# EAGLE schematic m2_to_apple (EAGLE 9.6.2)
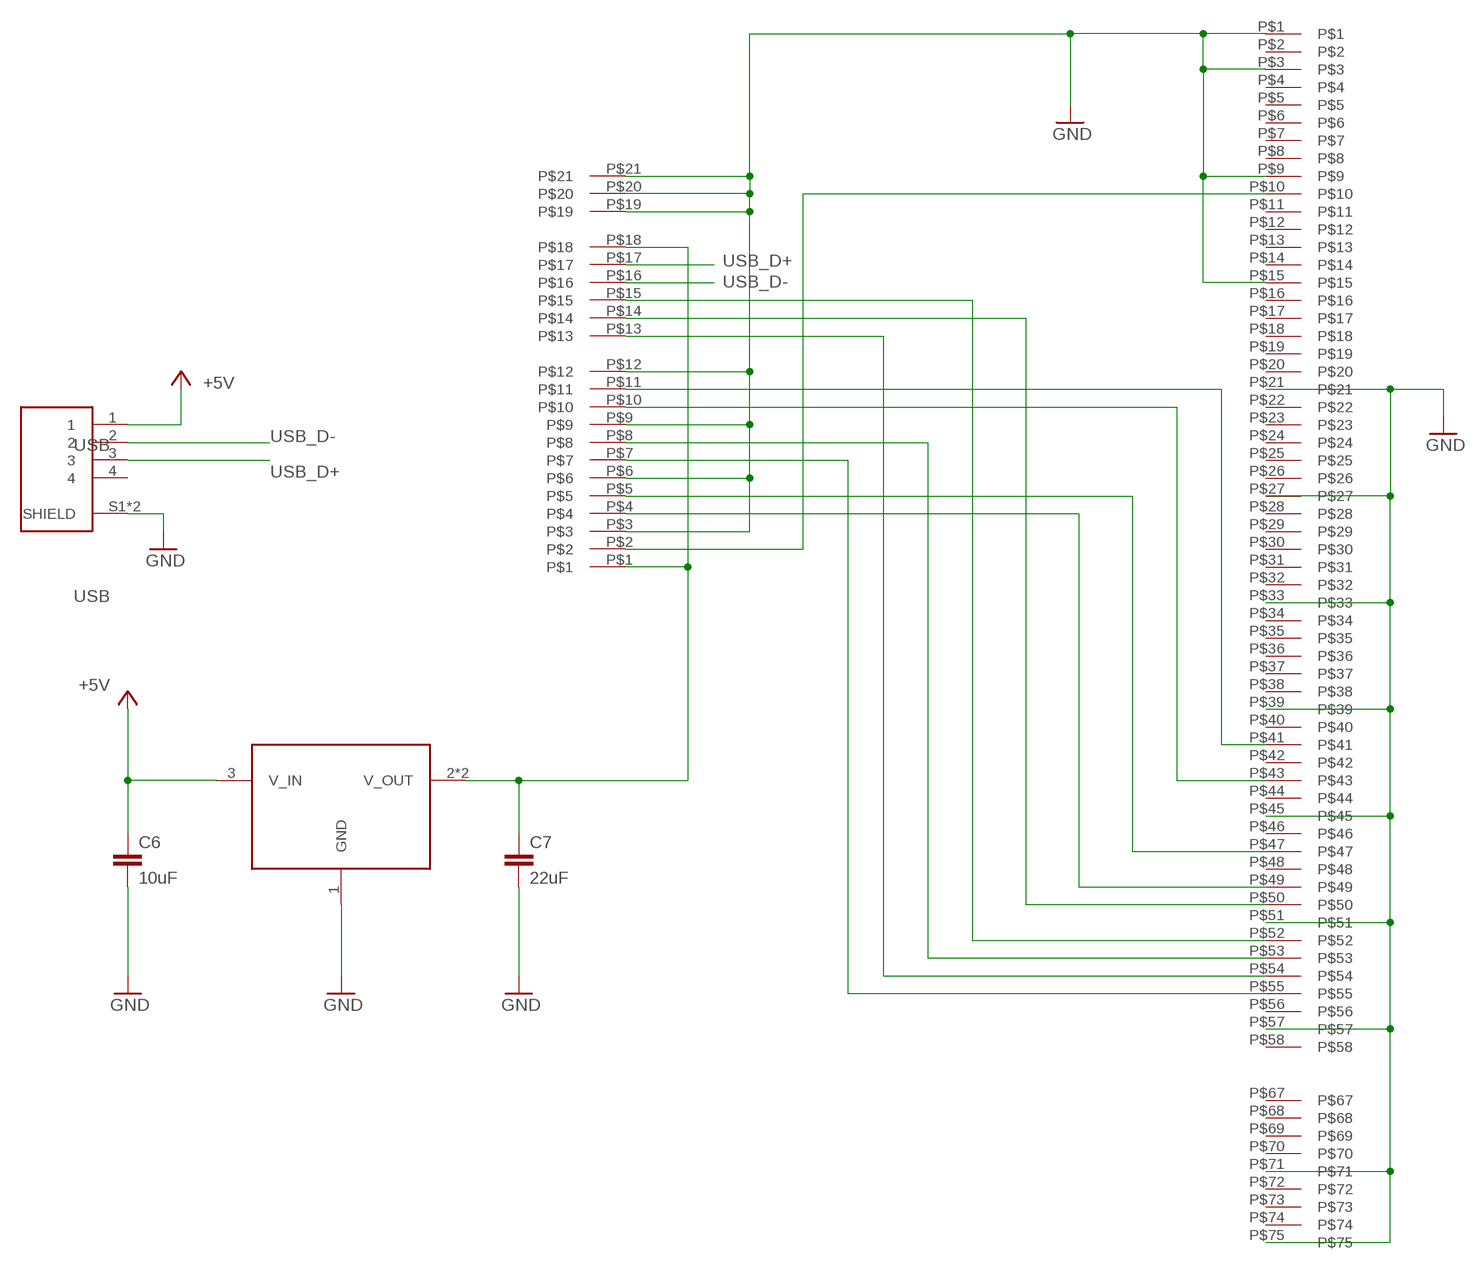
[diagram p0: schematic, sheet 1]

## Parts
C6  10uF  C0603C100C5GACTU  [CAP_0603]
C7  22uF  C0603C100C5GACTU  [CAP_0603]
U$1  APPLE-WIFI  [APPLE_WIFI]
U$2  M.2_KEY_MSMD  [M.2_KEY_M]
U$3  LM1117  [SOT223]
USB  USB  JST_1MM_4PINS  [JST_1MM_4PINS]

## Nets
3V3: C7.1 U$1.P$1 U$1.P$18 U$3.2(V_OUT) U$3.4(V_OUT)
+5V: C6.1 U$3.3(V_IN) USB.1
CLKREQ#: U$1.P$15 U$2.P$52
GND: C6.2 C7.2 U$1.P$3 U$1.P$6 U$1.P$9 U$1.P$12 U$1.P$19 U$1.P$20 U$1.P$21 U$2.P$1 U$2.P$3 U$2.P$9 U$2.P$15 U$2.P$21 U$2.P$27 U$2.P$33 U$2.P$39 U$2.P$45 U$2.P$51 U$2.P$57 U$2.P$71 U$2.P$75 U$3.1(GND) USB.S1(SHIELD) USB.S2(SHIELD)
PER+0: U$1.P$10 U$2.P$43
PER-0: U$1.P$11 U$2.P$41
PERST#: U$1.P$14 U$2.P$50
PET+0: U$1.P$4 U$2.P$49
PET-0: U$1.P$5 U$2.P$47
PEWAKE#: U$1.P$13 U$2.P$54
REFCLK+: U$1.P$7 U$2.P$55
REFCLK-: U$1.P$8 U$2.P$53
USB_D+: U$1.P$17 USB.3
USB_D-: U$1.P$16 USB.2
WLAN_LED: U$1.P$2 U$2.P$10
Unconnected: U$2.P$2 U$2.P$4 U$2.P$5 U$2.P$6 U$2.P$7 U$2.P$8 U$2.P$11 U$2.P$12 U$2.P$13 U$2.P$14 U$2.P$16 U$2.P$17 U$2.P$18 U$2.P$19 U$2.P$20 U$2.P$22 U$2.P$23 U$2.P$24 U$2.P$25 U$2.P$26 U$2.P$28 U$2.P$29 U$2.P$30 U$2.P$31 U$2.P$32 U$2.P$34 U$2.P$35 U$2.P$36 U$2.P$37 U$2.P$38 U$2.P$40 U$2.P$42 U$2.P$44 U$2.P$46 U$2.P$48 U$2.P$56 U$2.P$58 U$2.P$67 U$2.P$68 U$2.P$69 U$2.P$70 U$2.P$72 U$2.P$73 U$2.P$74 USB.4

## Library data of the parts
C6 C7 = Resistor_Capacitor:C0603C100C5GACTU: CAP CER 10PF 50V C0G/NP0 0603 Manufacturer's datasheet <https://content.kemet.com/datasheets/KEM_C1003_C0G_SMD.pdf>; CREATED_BY: PCBLayout.com; DIGIKEY_PART_NUMBER: 399-7814-2-ND; MANUFACTURER: KEMET; MPN: C0603C100C5GACTU; PACKAGE: SMD 0603
U$1 = M2_APPLE:APPLE-WIFI
U$2 = M2_APPLE:M.2_KEY_M: M.2 KEY M PCB Connector
U$3 = M2_APPLE:LM1117
USB = M2_APPLE:JST_1MM_4PINS: 4 pins SMD connector